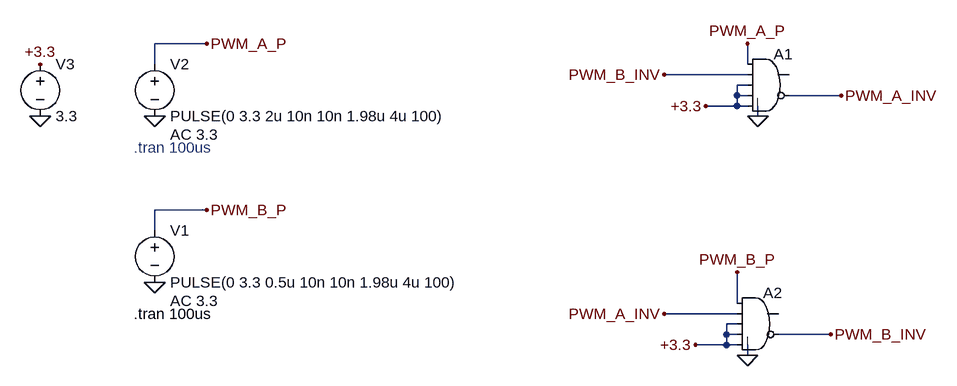
[diagram p0: schematic Draft1.asc]
Draft1.asc, the LTspice schematic file:
Version 4.1
SHEET 1 1572 680
WIRE 16 -176 -64 -176
WIRE -64 -144 -64 -176
WIRE 848 -144 848 -176
WIRE 848 -128 720 -128
WIRE 848 -112 832 -112
WIRE 832 -96 832 -112
WIRE 848 -96 832 -96
WIRE 992 -96 912 -96
WIRE 832 -80 832 -96
WIRE 832 -80 784 -80
WIRE 848 -80 832 -80
WIRE 864 -64 864 -80
WIRE 16 80 -64 80
WIRE -64 112 -64 80
WIRE 832 224 832 176
WIRE 832 240 720 240
WIRE 832 256 816 256
WIRE 816 272 816 256
WIRE 832 272 816 272
WIRE 976 272 896 272
WIRE 816 288 816 272
WIRE 816 288 768 288
WIRE 832 288 816 288
WIRE 848 304 848 288
FLAG -64 192 0
FLAG -64 -64 0
FLAG 16 -176 PWM_A_P
FLAG 16 80 PWM_B_P
FLAG 832 176 PWM_B_P
FLAG 992 -96 PWM_A_INV
FLAG 976 272 PWM_B_INV
FLAG 848 -176 PWM_A_P
FLAG 720 -128 PWM_B_INV
FLAG 720 240 PWM_A_INV
FLAG -240 -64 0
FLAG -240 -144 +3.3
FLAG 784 -80 +3.3
FLAG 768 288 +3.3
FLAG 864 -64 0
FLAG 848 304 0
SYMBOL voltage -64 96 R0
WINDOW 123 24 124 Left 2
WINDOW 39 0 0 Left 0
SYMATTR InstName V1
SYMATTR Value PULSE(0 3.3 0.5u 10n 10n 1.98u 4u 100)
SYMATTR Value2 AC 3.3
SYMBOL voltage -64 -160 R0
WINDOW 123 24 124 Left 2
WINDOW 39 0 0 Left 0
SYMATTR InstName V2
SYMATTR Value PULSE(0 3.3 2u 10n 10n 1.98u 4u 100)
SYMATTR Value2 AC 3.3
SYMBOL Digital\\and 880 -176 R0
SYMATTR InstName A1
SYMBOL Digital\\and 864 192 R0
SYMATTR InstName A2
SYMBOL voltage -240 -160 R0
WINDOW 123 0 0 Left 0
WINDOW 39 0 0 Left 0
SYMATTR InstName V3
SYMATTR Value 3.3
TEXT -96 240 Left 2 !.tran 100us
TEXT -96 -16 Left 2 ;.tran 100us

The netlist it stands for:
* Draft1.asc
V1 PWM_B_P 0 PULSE(0 3.3 0.5u 10n 10n 1.98u 4u 100) AC 3.3
V2 PWM_A_P 0 PULSE(0 3.3 2u 10n 10n 1.98u 4u 100) AC 3.3
A1 PWM_A_P PWM_B_INV +3.3 +3.3 +3.3 PWM_A_INV 0 0 AND
A2 PWM_B_P PWM_A_INV +3.3 +3.3 +3.3 PWM_B_INV 0 0 AND
V3 +3.3 0 3.3
.tran 100us
* .tran 100us
.backanno
.end